# Altium schematic sheet Microcontroller.SchDoc
size A3
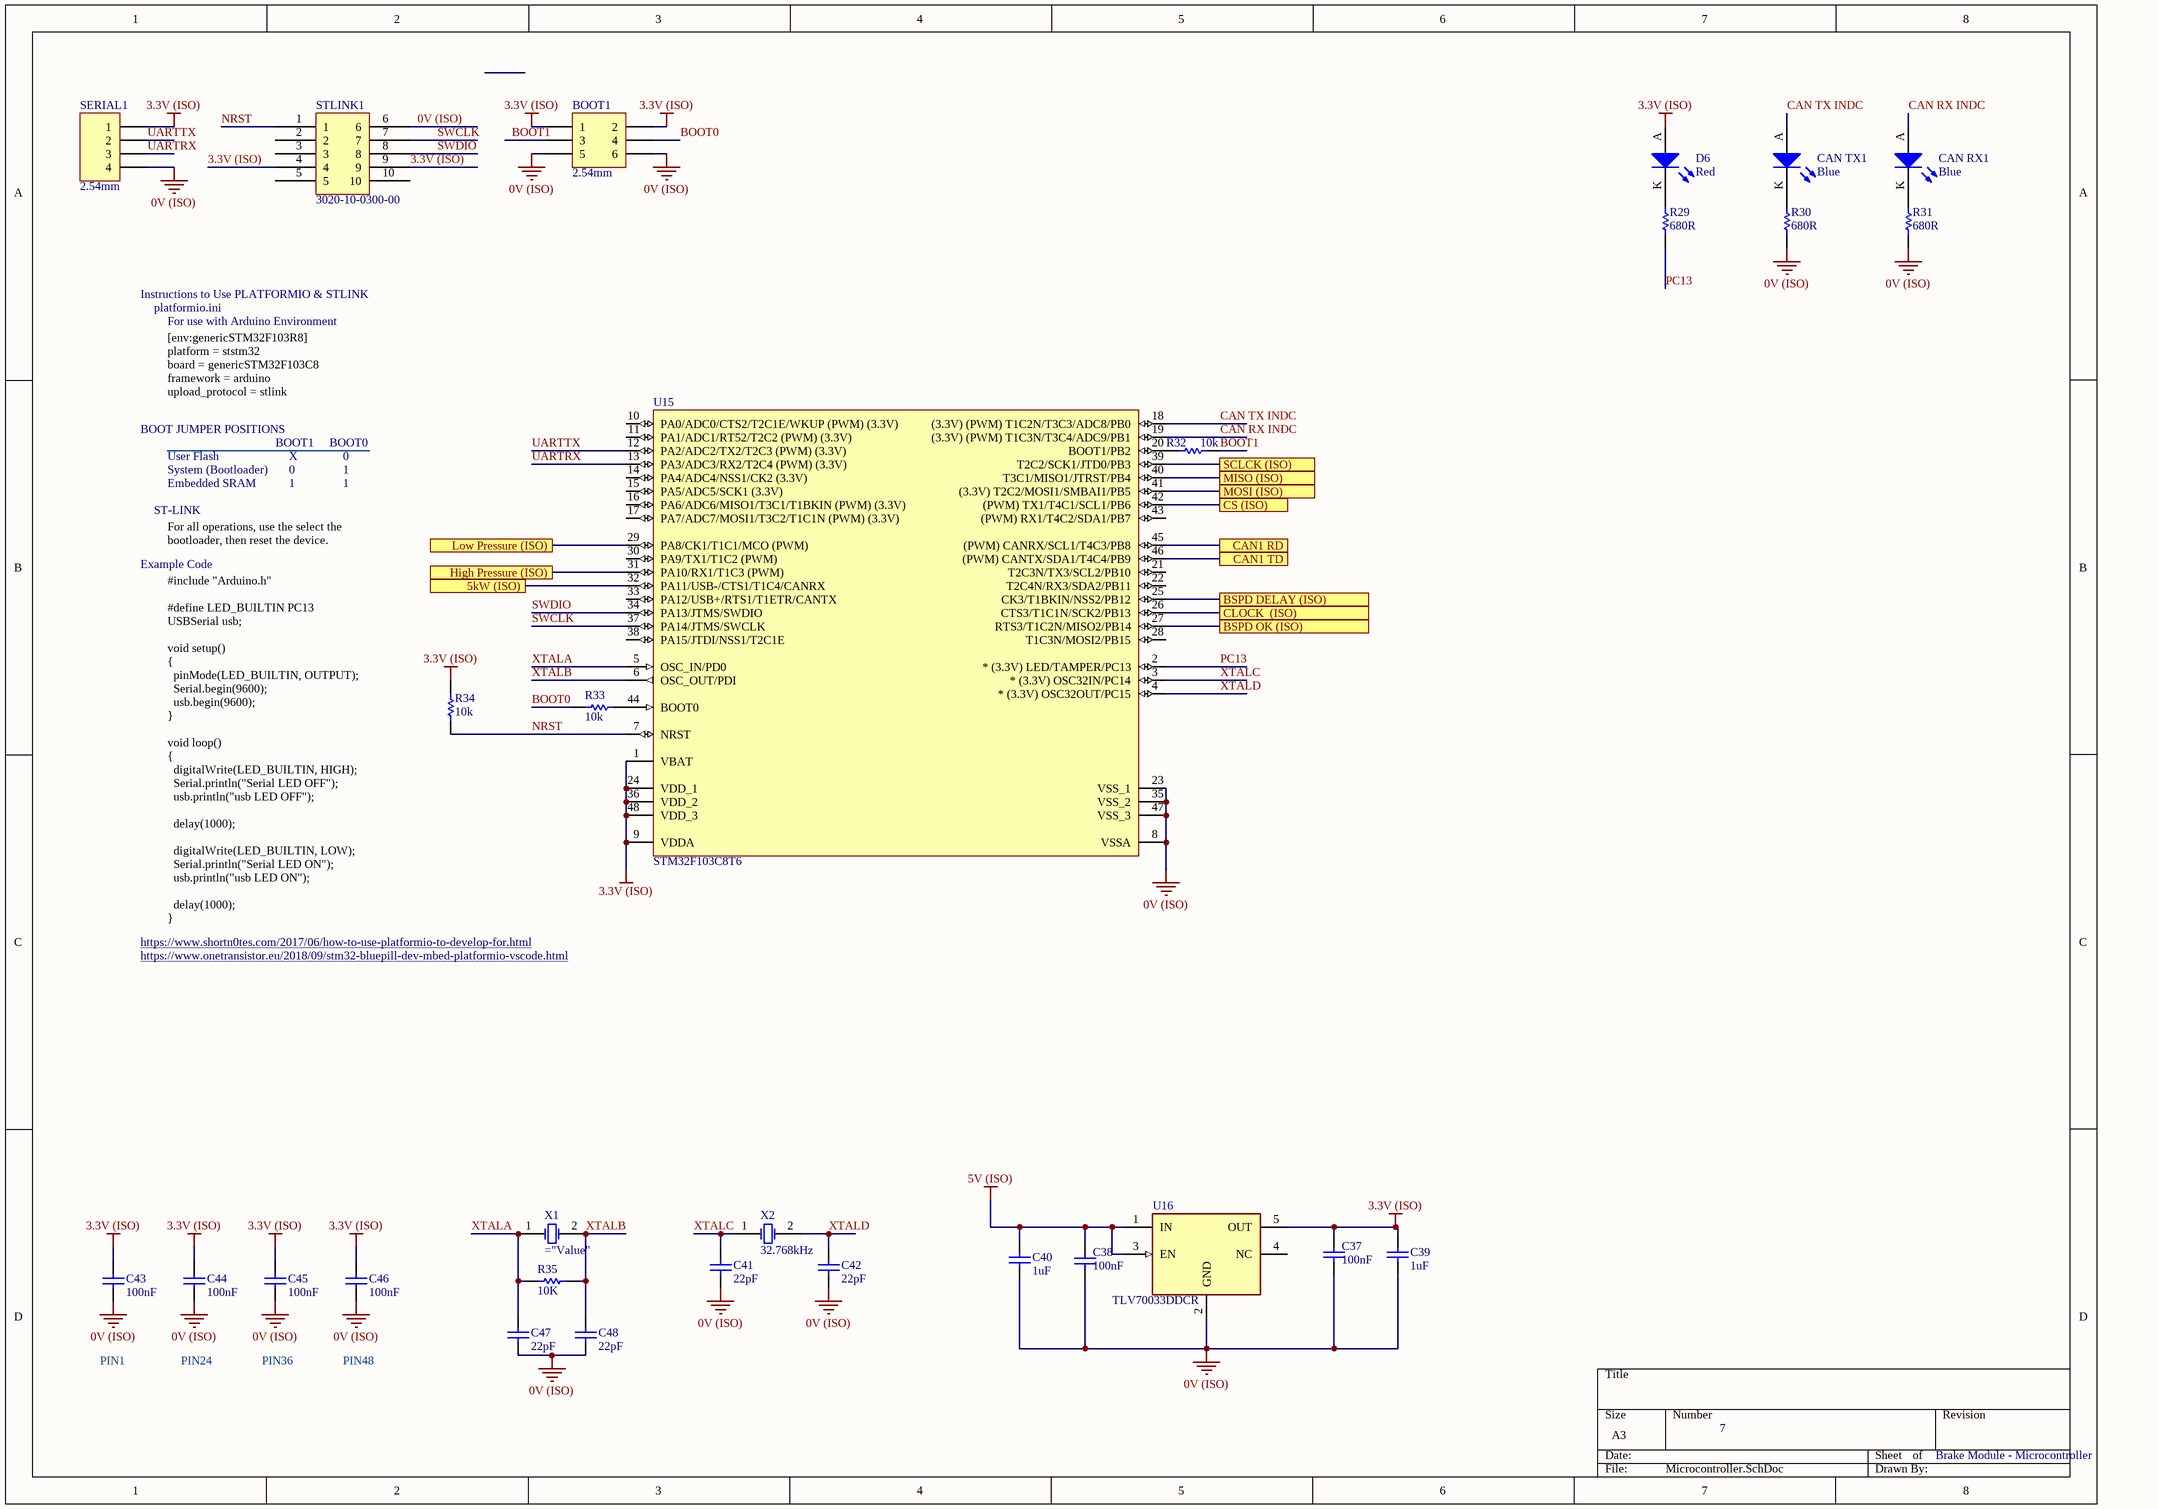
[diagram p0: Microcontroller.SchDoc]

## Parts
BOOT1  2.54mm  [TH 2.54mm Header 2x3]
C37  100nF  [C0603]
C38  100nF  [C0603]
C39  1uF  [0603]
C40  1uF  [0603]
C41  22pF  [C0603]
C42  22pF  [C0603]
C43  100nF  [C0603]
C44  100nF  [C0603]
C45  100nF  [C0603]
C46  100nF  [C0603]
C47  22pF  [C0603]
C48  22pF  [C0603]
CAN_RX1  Blue  [0805 LED]
CAN_TX1  Blue  [0805 LED]
D6  Red  [0805 LED]
R29  680R  [R0603]
R30  680R  [R0603]
R31  680R  [R0603]
R32  10k  [0805]
R33  10k  [0805]
R34  10k  [0805]
R35  10K  [R0603]
SERIAL1  2.54mm  [TH 2.54mm Header 1x4]
STLINK1  3020-10-0300-00  [3020-10-0300-00]
U15  STM32F103C8T6  [STM 48-LQFP]
U16  TLV70033DDCR  [FP-DDC0005A-IPC_B]
X1  (no value)  [ECS-80-18-30-JGN-TR]
X2  32.768kHz  [EPSON 2-SMD]

## Ports
5kW (ISO), BSPD DELAY (ISO), BSPD OK (ISO), CAN1 RD, CAN1 TD, CLOCK  (ISO), CS (ISO), High Pressure (ISO), Low Pressure (ISO), MISO (ISO), MOSI (ISO), SCLCK (ISO)

## Nets
0V (ISO): BOOT1.5 BOOT1.6 C37.1 C38.1 C39.1 C40.1 C41.1 C42.1 C43.1 C44.1 C45.1 C46.1 C47.1 C48.1 R30.2 R31.2 SERIAL1.4 STLINK1.6 U15.8(VSSA) U15.23(VSS_1) U15.35(VSS_2) U15.47(VSS_3) U16.2(GND)
3.3V (ISO): BOOT1.1 BOOT1.2 C37.2 C39.2 C43.2 C44.2 C45.2 C46.2 D6.A R34.2 SERIAL1.1 STLINK1.4 STLINK1.9 U15.1(VBAT) U15.9(VDDA) U15.24(VDD_1) U15.36(VDD_2) U15.48(VDD_3) U16.5(OUT)
5V (ISO): C38.2 C40.2 U16.1(IN) U16.3(EN)
5kW (ISO): U15.32(PA11/USB-/CTS1/T1C4/CANRX) ; port 5kW (ISO)
BOOT0: BOOT1.4 R33.1
BOOT1: BOOT1.3 R32.2
BSPD DELAY (ISO): U15.25(CK3/T1BKIN/NSS2/PB12) ; port BSPD DELAY (ISO)
BSPD OK (ISO): U15.27(RTS3/T1C2N/MISO2/PB14) ; port BSPD OK (ISO)
CAN1 RD: U15.45((PWM)_CANRX/SCL1/T4C3/PB8) ; port CAN1 RD
CAN1 TD: U15.46((PWM)_CANTX/SDA1/T4C4/PB9) ; port CAN1 TD
CAN RX INDC: CAN_RX1.A U15.19((3.3V)_(PWM)_T1C3N/T3C4/ADC9/PB1)
CAN TX INDC: CAN_TX1.A U15.18((3.3V)_(PWM)_T1C2N/T3C3/ADC8/PB0)
CLOCK  (ISO): U15.26(CTS3/T1C1N/SCK2/PB13) ; port CLOCK  (ISO)
CS (ISO): U15.42((PWM)_TX1/T4C1/SCL1/PB6) ; port CS (ISO)
High Pressure (ISO): U15.31(PA10/RX1/T1C3_(PWM)) ; port High Pressure (ISO)
Low Pressure (ISO): U15.29(PA8/CK1/T1C1/MCO_(PWM)) ; port Low Pressure (ISO)
MISO (ISO): U15.40(T3C1/MISO1/JTRST/PB4) ; port MISO (ISO)
MOSI (ISO): U15.41((3.3V)_T2C2/MOSI1/SMBAI1/PB5) ; port MOSI (ISO)
NRST: R34.1 STLINK1.1 U15.7(NRST)
PC13: R29.2 U15.2(*_(3.3V)_LED/TAMPER/PC13)
SCLCK (ISO): U15.39(T2C2/SCK1/JTD0/PB3) ; port SCLCK (ISO)
SWCLK: STLINK1.7 U15.37(PA14/JTMS/SWCLK)
SWDIO: STLINK1.8 U15.34(PA13/JTMS/SWDIO)
UARTRX: SERIAL1.3 U15.13(PA3/ADC3/RX2/T2C4_(PWM)_(3.3V))
UARTTX: SERIAL1.2 U15.12(PA2/ADC2/TX2/T2C3_(PWM)_(3.3V))
XTALA: C47.2 R35.1 U15.5(OSC_IN/PD0) X1.1(OSC1)
XTALB: C48.2 R35.2 U15.6(OSC_OUT/PDI) X1.2(OSC2)
XTALC: C41.2 U15.3(*_(3.3V)_OSC32IN/PC14) X2.1(OSC1)
XTALD: C42.2 U15.4(*_(3.3V)_OSC32OUT/PC15) X2.2(OSC2)
NetCAN_RX1_K: CAN_RX1.K R31.1
NetCAN_TX1_K: CAN_TX1.K R30.1
NetD6_K: D6.K R29.1
NetR32_1: R32.1 U15.20(BOOT1/PB2)
NetR33_2: R33.2 U15.44(BOOT0)

Not connected (* = marked no-connect by the designer): STLINK1 2 3 5 10; U15 10(PA0/ADC0/CTS2/T2C1E/WKUP_(PWM)_(3.3V)) 11(PA1/ADC1/RT52/T2C2_(PWM)_(3.3V)) 14(PA4/ADC4/NSS1/CK2_(3.3V)) 15(PA5/ADC5/SCK1_(3.3V)) 16(PA6/ADC6/MISO1/T3C1/T1BKIN_(PWM)_(3.3V)) 17(PA7/ADC7/MOSI1/T3C2/T1C1N_(PWM)_(3.3V)) 21(T2C3N/TX3/SCL2/PB10) 22(T2C4N/RX3/SDA2/PB11) 28(T1C3N/MOSI2/PB15) 30(PA9/TX1/T1C2_(PWM)) 33(PA12/USB+/RTS1/T1ETR/CANTX) 38(PA15/JTDI/NSS1/T2C1E) 43((PWM)_RX1/T4C2/SDA1/PB7); U16 4(NC)

## Notes on the sheet
- Instructions to Use PLATFORMIO & STLINK
- platformio.ini
- For use with Arduino Environment
- BOOT JUMPER POSITIONS
- [env:genericSTM32F103R8]
  platform = ststm32
  board = genericSTM32F103C8
  framework = arduino
  upload_protocol = stlink
- BOOT1
- BOOT0
- ST-LINK
- User Flash
- System (Bootloader)
- Embedded SRAM
- X
- 1
- 0
- Example Code
- For all operations, use the select the bootloader, then reset the device.
- #include "Arduino.h"
  #define LED_BUILTIN PC13
  USBSerial usb;
  void setup()
  {
  pinMode(LED_BUILTIN, OUTPUT);
  Serial.begin(9600);
  usb.begin(9600);
  }
  void loop()
  {
  digitalWrite(LED_BUILTIN, HIGH);
  Serial.println("Serial LED OFF");
  usb.println("usb LED OFF");
  delay(1000);
  digitalWrite(LED_BUILTIN, LOW);
  Serial.println("Serial LED ON");
  usb.println("usb LED ON");
  delay(1000);
  }
- https://www.shortn0tes.com/2017/06/how-to-use-platformio-to-develop-for.html
- https://www.onetransistor.eu/2018/09/stm32-bluepill-dev-mbed-platformio-vscode.html
- PIN1
- PIN24
- PIN36
- PIN48
- 7
- Brake Module - Microcontroller
- Title
- Size:
- Date:
- A3
- Number:
- Time:
- Revision:
- Sheet
- of
- File:

## Library data of the parts
BOOT1 = TH 2.54mm Header 2x3: Positions: 6; Angle: 0; Flange: No; Contact: NA; Part Number: TH 2.54mm Header 2x3; Pitch: 2.54mm; Row Spacing: 2.54mm
C37 C38 C43-C46 = CC0603ZPY5V9BB104: Tolerance: 5%; Material: C0G; Rated Voltage: 50V; Part Number: CC0603ZPY5V9BB104; Digikey Link: #https://www.digikey.com.au/en/products/detail/yageo/CC0603ZPY5V9BB104/11490657#; Value: 100nF
C39 C40 = GRT188R61H105ME13D: Manufacturer: muRata; Tolerance: 20%; Material: X5R; Rated Voltage: 50V; Part Number: GRT188R61H105ME13D; Value: 1uF; Digikey Part Number: GRT188R61H105ME13D
C41 C42 C47 C48 = CC0603JPNPO9BN220: Tolerance: 5%; Material: C0G; Rated Voltage: 50V; Part Number: CC0603JPNPO9BN220; Value: 22pF; Digikey Link: #https://www.digikey.com.au/en/products/detail/yageo/CC0603JPNPO9BN220/11490454#
CAN_RX1 CAN_TX1 = SML-MN2BCTT86C: LED BLUE CLEAR 2012 SMD; Manufacturer: ROHM Semiconductor; Part Number: SML-MN2BCTT86C; Colour: Blue; Digikey Part Number: 846-1207-1-ND; Digikey Link: https://www.digikey.com/product-detail/en/rohm-semiconductor/SMLMN2BCTT86C/846-1207-1-ND/6057239
D6 = SML-210LTT86: Red LED Indication - Discrete 1.75V 0805 (2012 Metric); Manufacturer: ROHM Semiconductor; Part Number: SML-210LTT86; Colour: Red; Digikey Part Number: 511-1286-1-ND; Digikey Link: https://www.digikey.com/product-detail/en/rohm-semiconductor/SML-210LTT86/511-1286-1-ND/637099
R29-R31 = RCP0603B680RGEA: Tolerance: 2%; Part Number: RCP0603B680RGEA; Value: 680R; Material: Thick Film; Digikey Link: #https://www.digikey.com.au/en/products/detail/vishay-dale/RCP0603B680RGEA/5791729#
R32-R34 = RC0805FR0710KL: Manufacturer: YAGEO; Tolerance: 0.01; Rated Voltage: 0.125W; Part Number: RC0805FR0710KL; Value: 10k; Material: FR-07; Digikey Part Number: 311-10.0KCRCT-ND
R35 = RA73F1J10KBTD: Tolerance: 0.1%; Part Number: RA73F1J10KBTD; Value: 10K; Material: Thin Film; Digikey Link: #https://www.digikey.com.au/en/products/detail/te-connectivity-passive-product/RA73F1J10KBTD/16031729#
SERIAL1 = TH 2.54mm Header 1x4: Positions: 4; Angle: 0; Flange: No; Contact: NA; Part Number: TH 2.54mm Header 1x4; Pitch: 2.54mm; Row Spacing: 2.54mm
STLINK1 = 3020-10-0300-00: Header SMD 2.54mm 2x05; Part Number: 3020-10-0300-00; Digikey Link: #https://www.digikey.com.au/en/products/detail/cnc-tech/3020-10-0300-00/3441727#
U15 = STM32F103C8T6: ARM® Cortex®-M3 STM32F1 Microcontroller IC 32-Bit 72MHz 64KB (64K x 8) FLASH; Manufacturer: STMicroelectronics; Part Number: STM32F103C8T6; Digikey Part Number: 497-6063-ND; Digikey Link: https://www.digikey.com/product-detail/en/stmicroelectronics/STM32F103C8T6/497-6063-ND/1646338
U16 = CMP-001-0011-2: Fixed Positive LDO Regulator, 3.3V, 0.25V Dropout, PMOS, PDSO5; Dropout Voltage1-Nom: 175mV; Input Voltage Absolute-Max: 6V; Package Equivalence Code: TSOP5/6,.11,37; Package Body Material: Plastic; Voltage Tolerance-Max: 2%; Max Supply Voltage: 5.5V; Channels: 1; Dropout Voltage1-Max: 250mV; Regulator Type: FIXED POSITIVE SINGLE OUTPUT LDO REGULATOR; Output Current1-Max: 200mA; Min Input Voltage: 2V; Output Voltage1-Min: 3.234V; Load Regulation-Max: 0.015%; Line Regulation-Max: 0.005%; Output Voltage1-Max: 3.366V; Qualification Status: Not Qualified; Reach SVHC Compliant: Yes; JESD-30 Code: R-PDSO-G5; Terminal Position: DUAL; Pins: 5; Moisture Sensitivity Level: 2; Length: 2.9mm; Operating Temperature, TJ-Min: -40°C; Operating Temperature, TJ-Max: 125°C; Package Shape: Rectangular; Output Voltage1-Nom: 3.3V; Packaging: Tape and Reel; Surface Mount: Yes; Number of Outputs: 1; JESD-609 Code: e4; Adjustability: FIXED; Technology: PMOS; Peak Reflow Temperature (Cel): 260°C; Terminal Form: Gull Wing; Case/Package: TSSOP; Height - Seated (Max): 1.1mm; Package Style: SMALL OUTLINE, THIN PROFILE, SHRINK PITCHMeter; Terminal Finish: Nickel; RoHS Compliant: Yes; Terminal Pitch: 0.95mm; Width: 1.6mm
X1 = ECS-80-18-30-JGN-TR: Crystal 8MHz; Part Number: ECS-80-18-30-JGN-TR; Digikey Link: #https://www.digikey.com.au/en/products/detail/ecs-inc/ECS-80-18-30-JGN-TR/5875530?s=N4IgTCBcDaIKIGEDKBaAHABhQRjSgzFgFIDiAcigCoBKIAugL5A#
X2 = FC-135 32.7680KA-A5: Manufacturer: EPSON; Load Capacitance: 12.5pF; ESR: 70k; Part Number: FC-135 32.7680KA-A5; Value: 32.768kHz; Digikey Part Number: SER4103TR-ND; Digikey Link: https://www.digikey.com/product-detail/en/epson/FC-135-32.7680KA-A5/SER4103TR-ND/5259895